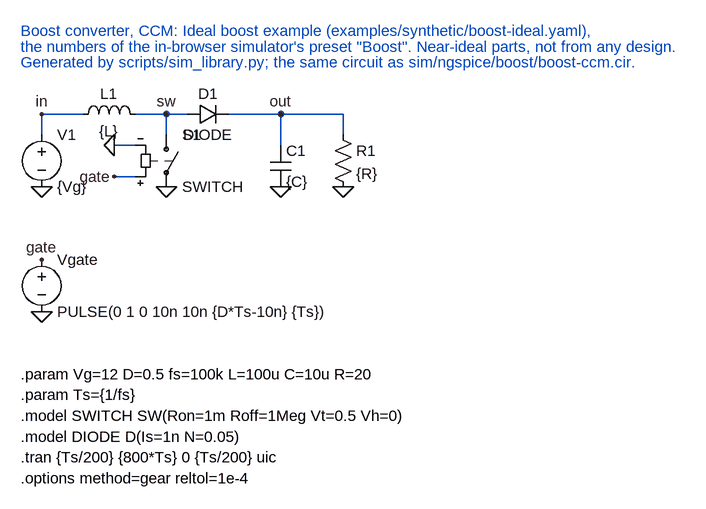
[diagram p0: schematic boost-ccm.asc]
boost-ccm.asc, the LTspice schematic file:
Version 4
SHEET 1 624 848
WIRE 0 64 0 96
WIRE 0 64 64 64
WIRE 144 64 192 64
WIRE 144 160 112 160
WIRE 144 112 112 112
WIRE 192 64 192 96
WIRE 192 64 224 64
WIRE 288 64 368 64
WIRE 368 64 368 112
WIRE 368 64 464 64
WIRE 464 64 464 96
FLAG 0 64 in
FLAG 0 176 0
FLAG 0 288 gate
FLAG 0 368 0
FLAG 112 160 gate
FLAG 112 112 0
FLAG 192 176 0
FLAG 192 64 sw
FLAG 368 176 0
FLAG 464 176 0
FLAG 368 64 out
SYMBOL voltage 0 80 R0
SYMATTR InstName V1
SYMATTR Value {Vg}
SYMBOL voltage 0 272 R0
SYMATTR InstName Vgate
SYMATTR Value PULSE(0 1 0 10n 10n {D*Ts-10n} {Ts})
SYMBOL ind 48 80 R270
WINDOW 0 32 56 VTop 2
WINDOW 3 5 56 VBottom 2
SYMATTR InstName L1
SYMATTR Value {L}
SYMBOL sw 192 80 R0
SYMATTR InstName S1
SYMATTR Value SWITCH
SYMBOL diode 224 80 R270
WINDOW 0 32 32 VTop 2
WINDOW 3 0 32 VBottom 2
SYMATTR InstName D1
SYMATTR Value DIODE
SYMBOL cap 352 112 R0
SYMATTR InstName C1
SYMATTR Value {C}
SYMBOL res 448 80 R0
SYMATTR InstName R1
SYMATTR Value {R}
TEXT -32 -64 Left 2 ;Boost converter, CCM: Ideal boost example (examples/synthetic/boost-ideal.yaml),
TEXT -32 -40 Left 2 ;the numbers of the in-browser simulator's preset "Boost". Near-ideal parts, not from any design.
TEXT -32 -16 Left 2 ;Generated by scripts/sim_library.py; the same circuit as sim/ngspice/boost/boost-ccm.cir.
TEXT -32 464 Left 2 !.param Vg=12 D=0.5 fs=100k L=100u C=10u R=20
TEXT -32 496 Left 2 !.param Ts={1/fs}
TEXT -32 528 Left 2 !.model SWITCH SW(Ron=1m Roff=1Meg Vt=0.5 Vh=0)
TEXT -32 560 Left 2 !.model DIODE D(Is=1n N=0.05)
TEXT -32 592 Left 2 !.tran {Ts/200} {800*Ts} 0 {Ts/200} uic
TEXT -32 624 Left 2 !.options method=gear reltol=1e-4

The netlist it stands for:
* boost-ccm.asc
V1 in 0 {Vg}
Vgate gate 0 PULSE(0 1 0 10n 10n {D*Ts-10n} {Ts})
L1 in sw {L}
S1 sw 0 gate 0 SWITCH
D1 sw out DIODE
C1 out 0 {C}
R1 out 0 {R}
.model D D
.lib standard.dio
* Boost converter, CCM: Ideal boost example (examples/synthetic/boost-ideal.yaml),
* the numbers of the in-browser simulator's preset "Boost". Near-ideal parts, not from any design.
* Generated by scripts/sim_library.py; the same circuit as sim/ngspice/boost/boost-ccm.cir.
.param Vg=12 D=0.5 fs=100k L=100u C=10u R=20
.param Ts={1/fs}
.model SWITCH SW(Ron=1m Roff=1Meg Vt=0.5 Vh=0)
.model DIODE D(Is=1n N=0.05)
.tran {Ts/200} {800*Ts} 0 {Ts/200} uic
.options method=gear reltol=1e-4
.backanno
.end